# Altium schematic sheet BMS AFE - Connectors.SchDoc: Title
size B; Organization: Midnight Sun Solar Rayce Car Team; Address1: University of Waterloo; Address2: 200 University Ave W; Address3: Waterloo, ON, Canada; Address4: N2L 3E9; DocumentNumber: 2; SheetNumber: 2; SheetTotal: 7; Website: www.uwmidsun.com; ProjectName: ProjectName
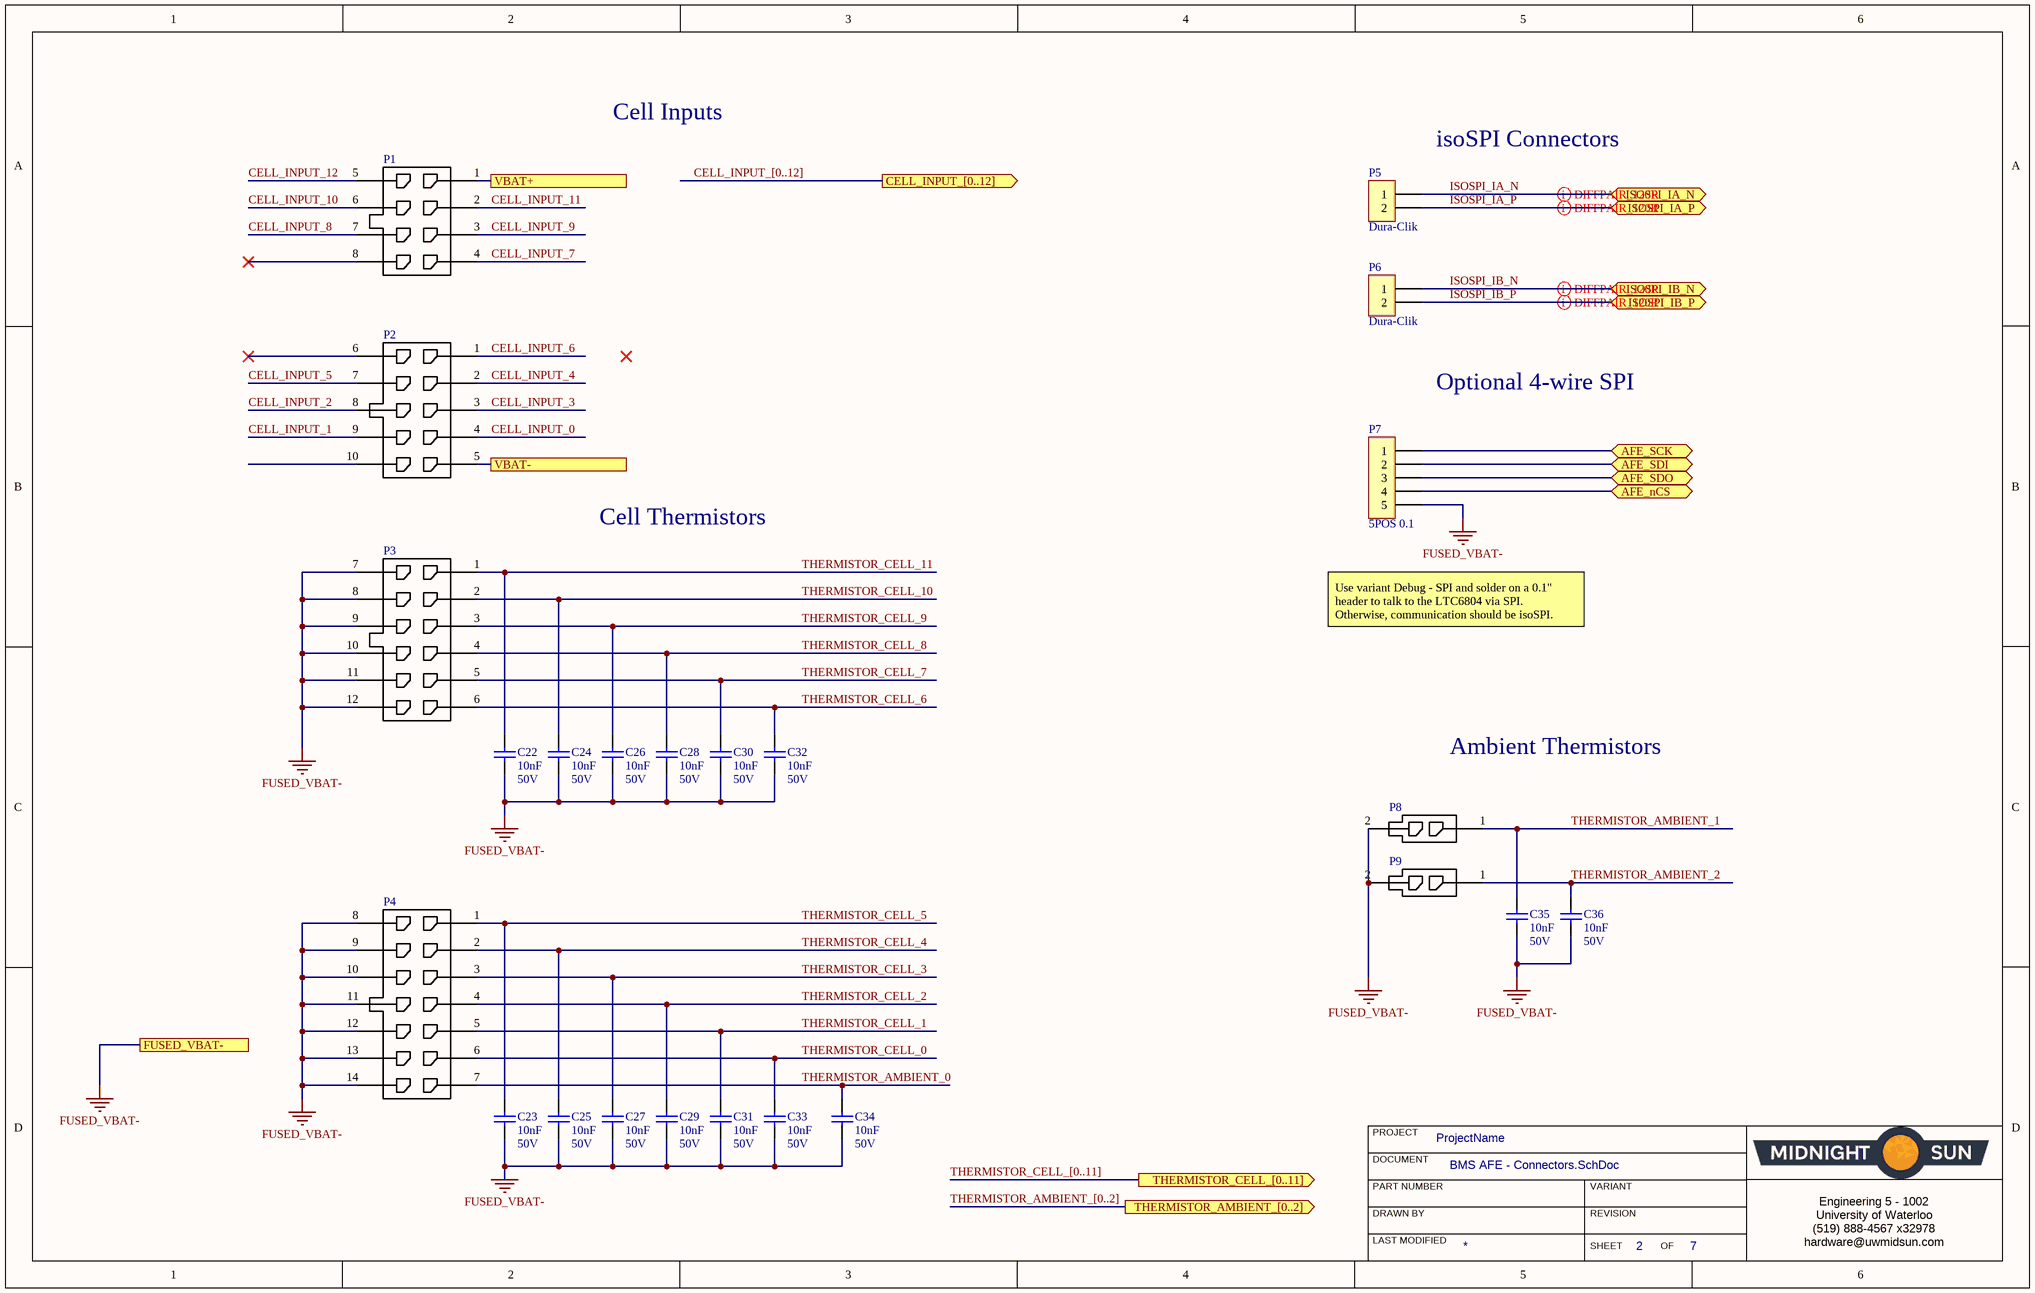
[diagram p0: BMS AFE - Connectors.SchDoc]

## Parts
C22  Capacitance: 10nF  Voltage: 50V  [CAP, 0603]  (hidden comment: CAP CER 10nF 50V 5% X7R 0603)
C23  Capacitance: 10nF  Voltage: 50V  [CAP, 0603]  (hidden comment: CAP CER 10nF 50V 5% X7R 0603)
C24  Capacitance: 10nF  Voltage: 50V  [CAP, 0603]  (hidden comment: CAP CER 10nF 50V 5% X7R 0603)
C25  Capacitance: 10nF  Voltage: 50V  [CAP, 0603]  (hidden comment: CAP CER 10nF 50V 5% X7R 0603)
C26  Capacitance: 10nF  Voltage: 50V  [CAP, 0603]  (hidden comment: CAP CER 10nF 50V 5% X7R 0603)
C27  Capacitance: 10nF  Voltage: 50V  [CAP, 0603]  (hidden comment: CAP CER 10nF 50V 5% X7R 0603)
C28  Capacitance: 10nF  Voltage: 50V  [CAP, 0603]  (hidden comment: CAP CER 10nF 50V 5% X7R 0603)
C29  Capacitance: 10nF  Voltage: 50V  [CAP, 0603]  (hidden comment: CAP CER 10nF 50V 5% X7R 0603)
C30  Capacitance: 10nF  Voltage: 50V  [CAP, 0603]  (hidden comment: CAP CER 10nF 50V 5% X7R 0603)
C31  Capacitance: 10nF  Voltage: 50V  [CAP, 0603]  (hidden comment: CAP CER 10nF 50V 5% X7R 0603)
C32  Capacitance: 10nF  Voltage: 50V  [CAP, 0603]  (hidden comment: CAP CER 10nF 50V 5% X7R 0603)
C33  Capacitance: 10nF  Voltage: 50V  [CAP, 0603]  (hidden comment: CAP CER 10nF 50V 5% X7R 0603)
C34  Capacitance: 10nF  Voltage: 50V  [CAP, 0603]  (hidden comment: CAP CER 10nF 50V 5% X7R 0603)
C35  Capacitance: 10nF  Voltage: 50V  [CAP, 0603]  (hidden comment: CAP CER 10nF 50V 5% X7R 0603)
C36  Capacitance: 10nF  Voltage: 50V  [CAP, 0603]  (hidden comment: CAP CER 10nF 50V 5% X7R 0603)
P1  CONN 8POS MICRO-FIT 3mm  (value not drawn)
P2  CONN 10POS MICRO-FIT 3mm  [CONN, 10POS MICRO-FIT 3mm]  (value not drawn)
P3  CONN 12POS MICRO-FIT 3mm  [CONN, 12POS MICRO-FIT 3mm]  (value not drawn)
P4  CONN 14POS MICRO-FIT 3mm  [CONN, 14POS MICRO-FIT 3mm]  (value not drawn)
P5  Dura-Clik  [CONN, 2POS Dura-Click Vertical]
P6  Dura-Clik  [CONN, 2POS Dura-Click Vertical]
P7  5POS 0.1  [CONN, 5POS HEADR 0.1"]
P8  CONN 2POS MICRO-FIT 3mm  [CONN, 2POS MICRO-FIT]  (value not drawn)
P9  CONN 2POS MICRO-FIT 3mm  [CONN, 2POS MICRO-FIT]  (value not drawn)

## Ports
AFE_nCS (bidir), AFE_SCK (bidir), AFE_SDI (bidir), AFE_SDO (bidir), CELL_INPUT_[0..12] (out), FUSED_VBAT-, ISOSPI_IA_N (bidir), ISOSPI_IA_P (bidir), ISOSPI_IB_N (bidir), ISOSPI_IB_P (bidir), THERMISTOR_AMBIENT_[0..2] (out), THERMISTOR_CELL_[0..11] (out), VBAT+, VBAT-

## Nets
FUSED_VBAT-: C22.2 C23.2 C24.2 C25.2 C26.2 C27.2 C28.2 C29.2 C30.2 C31.2 C32.2 C33.2 C34.2 C35.2 C36.2 P3.7 P3.8 P3.9 P3.10 P3.11 P3.12 P4.8 P4.9 P4.10 P4.11 P4.12 P4.13 P4.14 P7.5 P8.2 P9.2 ; port FUSED_VBAT-
AFE_nCS: P7.4 ; port AFE_nCS
AFE_SCK: P7.1 ; port AFE_SCK
AFE_SDI: P7.2 ; port AFE_SDI
AFE_SDO: P7.3 ; port AFE_SDO
CELL_INPUT_0: P2.4
CELL_INPUT_1: P2.9
CELL_INPUT_2: P2.8
CELL_INPUT_3: P2.3
CELL_INPUT_4: P2.2
CELL_INPUT_5: P2.7
CELL_INPUT_6: P2.1
CELL_INPUT_7: P1.4
CELL_INPUT_8: P1.7
CELL_INPUT_9: P1.3
CELL_INPUT_10: P1.6
CELL_INPUT_11: P1.2
CELL_INPUT_12: P1.5
ISOSPI_IA_N: P5.1 ; port ISOSPI_IA_N
ISOSPI_IA_P: P5.2 ; port ISOSPI_IA_P
ISOSPI_IB_N: P6.1 ; port ISOSPI_IB_N
ISOSPI_IB_P: P6.2 ; port ISOSPI_IB_P
THERMISTOR_AMBIENT_0: C34.1 P4.7
THERMISTOR_AMBIENT_1: C35.1 P8.1
THERMISTOR_AMBIENT_2: C36.1 P9.1
THERMISTOR_CELL_0: C33.1 P4.6
THERMISTOR_CELL_1: C31.1 P4.5
THERMISTOR_CELL_2: C29.1 P4.4
THERMISTOR_CELL_3: C27.1 P4.3
THERMISTOR_CELL_4: C25.1 P4.2
THERMISTOR_CELL_5: C23.1 P4.1
THERMISTOR_CELL_6: C32.1 P3.6
THERMISTOR_CELL_7: C30.1 P3.5
THERMISTOR_CELL_8: C28.1 P3.4
THERMISTOR_CELL_9: C26.1 P3.3
THERMISTOR_CELL_10: C24.1 P3.2
THERMISTOR_CELL_11: C22.1 P3.1
VBAT+: P1.1 ; port VBAT+
VBAT-: P2.5 ; port VBAT-

Not connected (* = marked no-connect by the designer): P1 8*; P2 6* 10

## Buses and harness runs
bus CELL_INPUT_[0..12] = port CELL_INPUT_[0..12]
bus THERMISTOR_AMBIENT_[0..2] = port THERMISTOR_AMBIENT_[0..2]
bus THERMISTOR_CELL_[0..11] = port THERMISTOR_CELL_[0..11]

## Layout directives
differential pair: ISOSPI_IA_N, ISOSPI_IA_P, ISOSPI_IB_N, ISOSPI_IB_P

## Notes on the sheet
- Cell Inputs
- isoSPI Connectors
- Optional 4-wire SPI
- Cell Thermistors
- Use variant Debug - SPI and solder on a 0.1" header to talk to the LTC6804 via SPI. Otherwise, communication should be isoSPI.
- Ambient Thermistors
- PROJECT
- DOCUMENT
- DRAWN BY
- LAST MODIFIED
- PART NUMBER
- REVISION
- SHEET
- VARIANT
- OF
- Engineering 5 - 1002
  University of Waterloo
  (519) 888-4567 x32978
  hardware@uwmidsun.com

## Library data of the parts
C22-C36 = CAP CER 10nF 50V 5% X7R 0603: 10000pF ±5% 50V Ceramic Capacitor U2J 0603 (1608 Metric); Manufacturer 1: KEMET; Manufacturer Part Number 1: C0603C103J5JAC7867; Supplier 1: Digi-Key; Supplier Part Number 1: 399-13384-1-ND; Packaging: Cut Tape (CT); Part Status: Active; Operating Temperature: -55°C ~ 125°C; Ratings: -; Failure Rate: -; Mounting Type: Surface Mount, MLCC; Package / Case: 0603 (1608 Metric); Size / Dimension: 0.063" L x 0.032" W (1.60mm x 0.80mm); Height - Seated (Max): -; Thickness (Max): 0.034" (0.87mm); Lead Spacing: -; Lead Style: -; ComponentLink1URL: http://www.kemet.com/docfinder?Partnumber=C0603C103J5JAC7867; ComponentLink1Description: http://www.kemet.com/docfinder?Partnumber=C0603C103J5JAC7867; Tolerance: ±5%; Temperature Coefficient: U2J
P1 = CONN 8POS MICRO-FIT 3mm: Connector Header Through Hole 6 position 0.118" (3.00mm); Manufacturer: Molex, LLC; Manufacturer Part Number: 0430450827; Number of Positions: 6; Number of Positions Loaded: All; Style: Board to Cable/Wire; Shrouding: Shrouded - 4 Wall; Contact Length - Post: 0.125" (3.18mm); Material Flammability Rating: UL94 V-0; RoHS: RoHS Compliant; Category: Connectors, Interconnects; Packaging: Tray; Part Status: Active; Connector Type: Header; Contact Type: Male Pin; Pitch - Mating: 0.118" (3.00mm); Number of Rows: 2; Row Spacing - Mating: 0.118" (3.00mm); Mounting Type: Through Hole; Termination: Solder; Fastening Type: Locking Ramp; Contact Length - Mating: -; Overall Contact Length: -; Insulation Height: 0.390" (9.91mm); Contact Shape: Square; Contact Finish - Mating: Tin; Contact Finish Thickness - Mating: 60.0µin (1.52µm); Contact Finish - Post: Tin; Contact Material: Brass; Insulation Material: Liquid Crystal Polymer (LCP), Glass Filled; Features: Board Guide; Operating Temperature: -; Ingress Protection: -; Insulation Color: Black; Current Rating: -; Voltage Rating: -; Mated Stacking Heights: -; Contact Finish Thickness - Post: -; Applications: General Purpose, Medical, Military, Telecommunications; ComponentLink1URL: https://www.molex.com/pdm_docs/sd/430450627_sd.pdf; ComponentLink1Description: https://www.molex.com/pdm_docs/sd/430450627_sd.pdf; Supplier 1: Digi-Key; Stock 1: 5553; Pricing 1: 1=2.69, 10=2.445, 25=2.2964, 50=2.1964, 100=2.0965, 250=1.8968, 500=1.74704, 1440=1.49746, 2880=1.39763 (CAD); ComponentLink2URL: https://www.molex.com/pdm_docs/sd/430450827_sd.pdf; ComponentLink2Description: https://www.molex.com/pdm_docs/sd/430450827_sd.pdf; Supplier Part Number 1: WM10684-ND
P2 = CONN 10POS MICRO-FIT 3mm: Connector Header Through Hole 10 position 0.118" (3.00mm); Manufacturer: Molex, LLC; Manufacturer Part Number: 0430451027; Number of Positions: 10; Number of Positions Loaded: All; Style: Board to Cable/Wire; Shrouding: Shrouded - 4 Wall; Contact Length - Post: 0.125" (3.18mm); Material Flammability Rating: UL94 V-0; Supplier 1: Digi-Key; RoHS: RoHS Compliant; Category: Connectors, Interconnects; Stock 1: 8114; Pricing 1: 1=3.15, 10=2.864, 100=2.455, 500=2.0458, 1224=1.75355, 6120=1.55481 (CAD); Packaging: Tray; Part Status: Active; Connector Type: Header; Contact Type: Male Pin; Pitch - Mating: 0.118" (3.00mm); Number of Rows: 2; Row Spacing - Mating: 0.118" (3.00mm); Mounting Type: Through Hole; Termination: Solder; Fastening Type: Locking Ramp; Contact Length - Mating: -; Overall Contact Length: -; Insulation Height: 0.390" (9.91mm); Contact Shape: Square; Contact Finish - Mating: Tin; Contact Finish Thickness - Mating: 60.0µin (1.52µm); Contact Finish - Post: Tin; Contact Material: Brass; Insulation Material: Liquid Crystal Polymer (LCP), Glass Filled; Features: Board Guide; Operating Temperature: -; Ingress Protection: -; Insulation Color: Black; Current Rating: -; Voltage Rating: -; Mated Stacking Heights: -; Contact Finish Thickness - Post: -; Applications: General Purpose, Medical, Military, Telecommunications; ComponentLink1URL: https://www.molex.com/pdm_docs/sd/430451027_sd.pdf; ComponentLink1Description: https://www.molex.com/pdm_docs/sd/430451027_sd.pdf; Supplier Part Number 1: WM7488-ND
P3 = CONN 12POS MICRO-FIT 3mm: Connector Header Through Hole 12 position 0.118" (3.00mm); Manufacturer: Molex, LLC; Manufacturer Part Number: 0430451227; Number of Positions: 12; Number of Positions Loaded: All; Style: Board to Cable/Wire; Shrouding: Shrouded - 4 Wall; Contact Length - Post: 0.125" (3.18mm); Material Flammability Rating: UL94 V-0; Supplier 1: Digi-Key; RoHS: RoHS Compliant; Category: Connectors, Interconnects; Stock 1: 1709; Pricing 1: 1=3.61, 10=3.283, 25=3.0816, 50=2.9478, 100=2.8138, 250=2.5458, 500=2.34482, 1008=2.00985, 3024=1.87586 (CAD); Packaging: Tray; Part Status: Active; Connector Type: Header; Contact Type: Male Pin; Pitch - Mating: 0.118" (3.00mm); Number of Rows: 2; Row Spacing - Mating: 0.118" (3.00mm); Mounting Type: Through Hole; Termination: Solder; Fastening Type: Locking Ramp; Contact Length - Mating: -; Overall Contact Length: -; Insulation Height: 0.390" (9.91mm); Contact Shape: Square; Contact Finish - Mating: Tin; Contact Finish Thickness - Mating: 60.0µin (1.52µm); Contact Finish - Post: Tin; Contact Material: Brass; Insulation Material: Liquid Crystal Polymer (LCP), Glass Filled; Features: Board Guide; Operating Temperature: -; Ingress Protection: -; Insulation Color: Black; Current Rating: -; Voltage Rating: -; Mated Stacking Heights: -; Contact Finish Thickness - Post: -; Applications: General Purpose, Medical, Military, Telecommunications; ComponentLink1URL: https://www.molex.com/pdm_docs/sd/430451227_sd.pdf; ComponentLink1Description: https://www.molex.com/pdm_docs/sd/430451227_sd.pdf; Supplier Part Number 1: WM10697-ND
P4 = CONN 14POS MICRO-FIT 3mm: Connector Header Through Hole 14 position 0.118" (3.00mm); Manufacturer: Molex, LLC; Manufacturer Part Number: 0430451427; Number of Positions: 14; Number of Positions Loaded: All; Style: Board to Cable/Wire; Shrouding: Shrouded - 4 Wall; Contact Length - Post: 0.125" (3.18mm); Material Flammability Rating: UL94 V-0; Supplier 1: Digi-Key; RoHS: RoHS Compliant; Category: Connectors, Interconnects; Stock 1: 829; Pricing 1: 1=4.57, 10=4.377, 25=4.0124, 50=3.8296, 100=3.6473, 250=3.1914, 936=2.82666, 1872=2.5531, 2808=2.46192 (CAD); Packaging: Tray; Part Status: Active; Connector Type: Header; Contact Type: Male Pin; Pitch - Mating: 0.118" (3.00mm); Number of Rows: 2; Row Spacing - Mating: 0.118" (3.00mm); Mounting Type: Through Hole; Termination: Solder; Fastening Type: Locking Ramp; Contact Length - Mating: -; Overall Contact Length: -; Insulation Height: 0.390" (9.91mm); Contact Shape: Square; Contact Finish - Mating: Tin; Contact Finish Thickness - Mating: 60.0µin (1.52µm); Contact Finish - Post: Tin; Contact Material: Brass; Insulation Material: Liquid Crystal Polymer (LCP), Glass Filled; Features: Board Guide; Operating Temperature: -; Ingress Protection: -; Insulation Color: Black; Current Rating: -; Voltage Rating: -; Mated Stacking Heights: -; Contact Finish Thickness - Post: -; Applications: General Purpose, Medical, Military, Telecommunications; ComponentLink1URL: https://www.molex.com/pdm_docs/sd/430451427_sd.pdf; ComponentLink1Description: https://www.molex.com/pdm_docs/sd/430451427_sd.pdf; Supplier Part Number 1: WM10707-ND
P5 P6 = CONN 2POS DURA-CLIK 0.079" VERT: 2 Positions Header, Shrouded Connector 0.079" (2.00mm) Surface Mount, Vertical Tin; Manufacturer: Molex, LLC; Manufacturer Part Number: 5600200220; Style: Board to Cable/Wire; Shrouding: Shrouded - 4 Wall; Number of Positions: 2; Number of Positions Loaded: All; Mated Stacking Heights: 9.3mm; Supplier 1: Digi-Key; RoHS: RoHS Compliant; Category: Connectors, Interconnects; Stock 1: 11912; Pricing 1: 1=1.16, 10=1.012, 25=0.952, 50=0.9122, 100=0.8727, 250=0.79336 (CAD); Packaging: Cut Tape (CT); Part Status: Active; Connector Type: Header; Contact Type: Male Pin; Pitch - Mating: 0.079" (2.00mm); Number of Rows: 1; Row Spacing - Mating: -; Mounting Type: Surface Mount; Termination: Solder; Fastening Type: Latch Lock; Contact Length - Mating: -; Contact Length - Post: -; Overall Contact Length: -; Insulation Height: 0.315" (8.00mm); Contact Shape: Square; Contact Finish - Mating: Tin; Contact Finish Thickness - Mating: -; Contact Finish - Post: Tin; Contact Material: Copper Alloy; Insulation Material: Polyamide (PA), Nylon; Features: Solder Retention; Operating Temperature: -; Ingress Protection: -; Material Flammability Rating: -; Insulation Color: Natural; Current Rating: -; Voltage Rating: -; Contact Finish Thickness - Post: -; Applications: Automotive, Industrial; ComponentLink1URL: http://www.molex.com/pdm_docs/sd/5600200220_sd.pdf; ComponentLink1Description: http://www.molex.com/pdm_docs/sd/5600200220_sd.pdf; Supplier Part Number 1: WM10862CT-ND
P7 = CONN 5POS HEADR MALE 0.1in: 5 Positions Header, Breakaway Connector 0.100" (2.54mm) Through Hole Tin; Manufacturer 1: Molex; Manufacturer Part Number 1: 0022284050; Description 1: Conn Unshrouded Header HDR 5 POS 2.54mm Solder ST Thru-Hole KK® Bag; Contact Resistance: 20mR; Number of Positions: 5; Gender: Male; Connector Type: Male Pin; Max Voltage Rating (AC): 250V; Supplier 1: Digi-Key; Supplier Part Number 1: WM50014-05-ND; Stock 1: 3161; Pricing 1: 1=0.22, 10=0.21, 25=0.1796, 50=0.157, 100=0.1459, 250=0.129, 500=0.1234 (USD); Mount: Through Hole; Colour: Black; Contact Plating: Nickel,Tin; Contact Material: Bronze,Brass; Housing Colour: Black; Housing Material: Nylon; Min Operating Temperature: 0°C; Max Operating Temperature: 75°C; Packaging: Bulk; Number of Rows: 1; Termination: Solder; Number of Contacts: 5; Orientation: Straight; Max Voltage Rating (DC): 250V; Length: 12.7mm; Pitch: 2.54mm; Depth: 2.49mm; Contact Mating Length: 0.24inch; ComponentLink1URL: https://datasheet.ciiva.com/6814/022284363-sd-6814049.pdf; ComponentLink1Description: https://datasheet.ciiva.com/6814/022284363-sd-6814049.pdf; ComponentLink2URL: https://datasheet.ciiva.com/14804/179390022284050-pcb-headers-14804361.pdf; ComponentLink2Description: https://datasheet.ciiva.com/14804/179390022284050-pcb-headers-14804361.pdf; ComponentLink3URL: https://datasheet.ciiva.com/15217/getdatasheetpartid-256138-15217709.pdf; ComponentLink3Description: https://datasheet.ciiva.com/15217/getdatasheetpartid-256138-15217709.pdf
P8 P9 = CONN 2POS MICRO-FIT 3mm: Connector Header Through Hole 2 position; Manufacturer: Molex; Manufacturer Part Number: 43045-0227; Number of Positions: 2; Gender: Male; Contact Resistance: 10mR; Number of Ports: 1; Max Voltage Rating (DC): 250.25kV; Current Rating: 5A; Voltage Rating: 600V; Glow Wire Compliant: Compliant; Supplier 1: Digi-Key; Stock 1: 3657; Pricing 1: 1=0.84, 10=0.74, 25=0.6968, 50=0.6676, 100=0.6387, 250=0.5806, 500=0.52254, 1000=0.46448, 2500=0.42094 (USD); Mount: Through Hole; Contact Plating: Tin; Contact Material: Brass; Housing Colour: Black; Housing Material: Thermoplastic; Number of Terminals: 2; Min Operating Temperature: -40°C; Max Operating Temperature: 105°C; Number of Rows: 2; Packaging: Tray; Termination: Solder; Number of Contacts: 2; Orientation: Vertical; Package Quantity: 3168; Number of Circuits: 2; Length: 7.15mm; Pitch: 3mm; Depth: 8.77mm; Row Spacing: 3mm; Radiation Hardening: No; Halogen Free: Low Halogen; ComponentLink1URL: http://www.onlinecomponents.com/productFiles/mf-MOL/307170430450227_pcb_headers.pdf; ComponentLink1Description: http://www.onlinecomponents.com/productFiles/mf-MOL/307170430450227_pcb_headers.pdf; ComponentLink2URL: http://www.mouser.com/ds/2/276/0430450227_PCB_HEADERS-142611.pdf; ComponentLink2Description: http://www.mouser.com/ds/2/276/0430450227_PCB_HEADERS-142611.pdf; ComponentLink3URL: http://uk.rs-online.com/webdocs/13c3/0900766b813c3a46.pdf; ComponentLink3Description: http://uk.rs-online.com/webdocs/13c3/0900766b813c3a46.pdf; ComponentLink4URL: http://www.molex.com/webdocs/datasheets/pdf/en-us/0430450227_PCB_HEADERS.pdf; ComponentLink4Description: http://www.molex.com/webdocs/datasheets/pdf/en-us/0430450227_PCB_HEADERS.pdf; Supplier Part Number 1: WM10657-ND